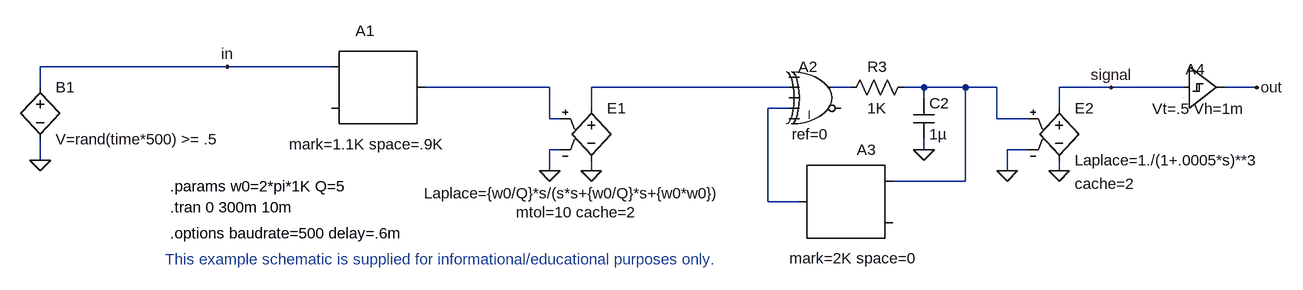
[diagram p0: schematic Eye.asc]
Eye.asc, the LTspice schematic file:
Version 4
SHEET 1 1672 1576
WIRE -256 912 -256 880
WIRE -256 1024 -256 992
WIRE 32 880 -256 880
WIRE 192 880 32 880
WIRE 528 912 336 912
WIRE 528 960 528 912
WIRE 528 1040 528 1008
WIRE 544 960 528 960
WIRE 544 1008 528 1008
WIRE 592 944 592 912
WIRE 592 1040 592 1024
WIRE 864 1088 864 944
WIRE 896 912 592 912
WIRE 896 944 864 944
WIRE 912 1088 864 1088
WIRE 992 912 960 912
WIRE 1104 912 1072 912
WIRE 1104 928 1104 912
WIRE 1104 1008 1104 992
WIRE 1168 912 1104 912
WIRE 1168 1056 1056 1056
WIRE 1168 1056 1168 912
WIRE 1216 912 1168 912
WIRE 1216 960 1216 912
WIRE 1232 1040 1232 1008
WIRE 1264 960 1216 960
WIRE 1264 1008 1232 1008
WIRE 1312 944 1312 912
WIRE 1312 1040 1312 1024
WIRE 1392 912 1312 912
WIRE 1504 912 1392 912
WIRE 1616 912 1568 912
FLAG -256 1024 0
FLAG 32 880 in
FLAG 1104 1008 0
FLAG 1232 1040 0
FLAG 1312 1040 0
FLAG 528 1040 0
FLAG 592 1040 0
FLAG 1616 912 out
FLAG 1392 912 signal
SYMBOL SPECIALFUNCTIONS\\MODULATE 192 880 R0
WINDOW 0 37 -55 Left 0
WINDOW 3 55 119 Center 0
SYMATTR InstName A1
SYMATTR Value mark=1.1K space=.9K
SYMBOL RES 1088 896 R90
WINDOW 0 0 56 VBottom 0
WINDOW 3 32 56 VTop 0
SYMATTR InstName R3
SYMATTR Value 1K
SYMBOL cap 1088 928 R0
SYMATTR InstName C2
SYMATTR Value 1µ
SYMBOL SPECIALFUNCTIONS\\MODULATE 1056 1056 M0
WINDOW 0 55 -48 Right 0
WINDOW 3 61 119 Center 0
SYMATTR InstName A3
SYMATTR Value mark=2K space=0
SYMBOL DIGITAL\\XOR 944 864 R0
WINDOW 0 -33 16 Left 0
WINDOW 3 -43 120 Left 0
SYMATTR InstName A2
SYMATTR Value ref=0
SYMBOL DIGITAL\\SCHMTBUF 1504 848 R0
WINDOW 0 3 36 Left 0
WINDOW 3 22 97 Center 0
SYMATTR InstName A4
SYMATTR Value Vt=.5 Vh=1m
SYMBOL E 1312 928 R0
WINDOW 123 24 132 Left 0
SYMATTR Value2 cache=2
SYMATTR InstName E2
SYMATTR Value Laplace=1./(1+.0005*s)**3
SYMBOL e 592 928 R0
WINDOW 3 -28 147 Center 0
WINDOW 39 -116 176 Left 0
SYMATTR Value Laplace={w0/Q}*s/(s*s+{w0/Q}*s+{w0*w0})
SYMATTR SpiceLine mtol=10 cache=2
SYMATTR InstName E1
SYMBOL BV -256 896 R0
SYMATTR InstName B1
SYMATTR Value V=rand(time*500) >= .5
TEXT -56 1096 Left 0 !.tran 0 300m 10m
TEXT -56 1064 Left 0 !.params w0=2*pi*1K Q=5
TEXT -56 1136 Left 0 !.options baudrate=500 delay=.6m
TEXT -64 1176 Left 0 ;This example schematic is supplied for informational/educational purposes only.

The netlist it stands for:
* Eye.asc
A1 in 0 0 0 0 0 N001 0 MODULATOR mark=1.1K space=.9K
R3 N005 N004 1K
C2 N005 0 1µ
A3 N005 0 0 0 0 0 N003 0 MODULATOR mark=2K space=0
A2 0 N002 0 N003 0 0 N004 0 XOR ref=0
A4 signal 0 0 0 0 0 out 0 SCHMITT Vt=.5 Vh=1m
E2 signal 0 N005 0 Laplace=1./(1+.0005*s)**3 cache=2
E1 N002 0 N001 0 Laplace={w0/Q}*s/(s*s+{w0/Q}*s+{w0*w0}) mtol=10 cache=2
B1 in 0 V=rand(time*500) >= .5
.tran 0 300m 10m
.params w0=2*pi*1K Q=5
.options baudrate=500 delay=.6m
* This example schematic is supplied for informational/educational purposes only.
.backanno
.end